# EAGLE design Edin_TinyPico_Nano (EAGLE 8.0.1)

## Sheet 1 of 2
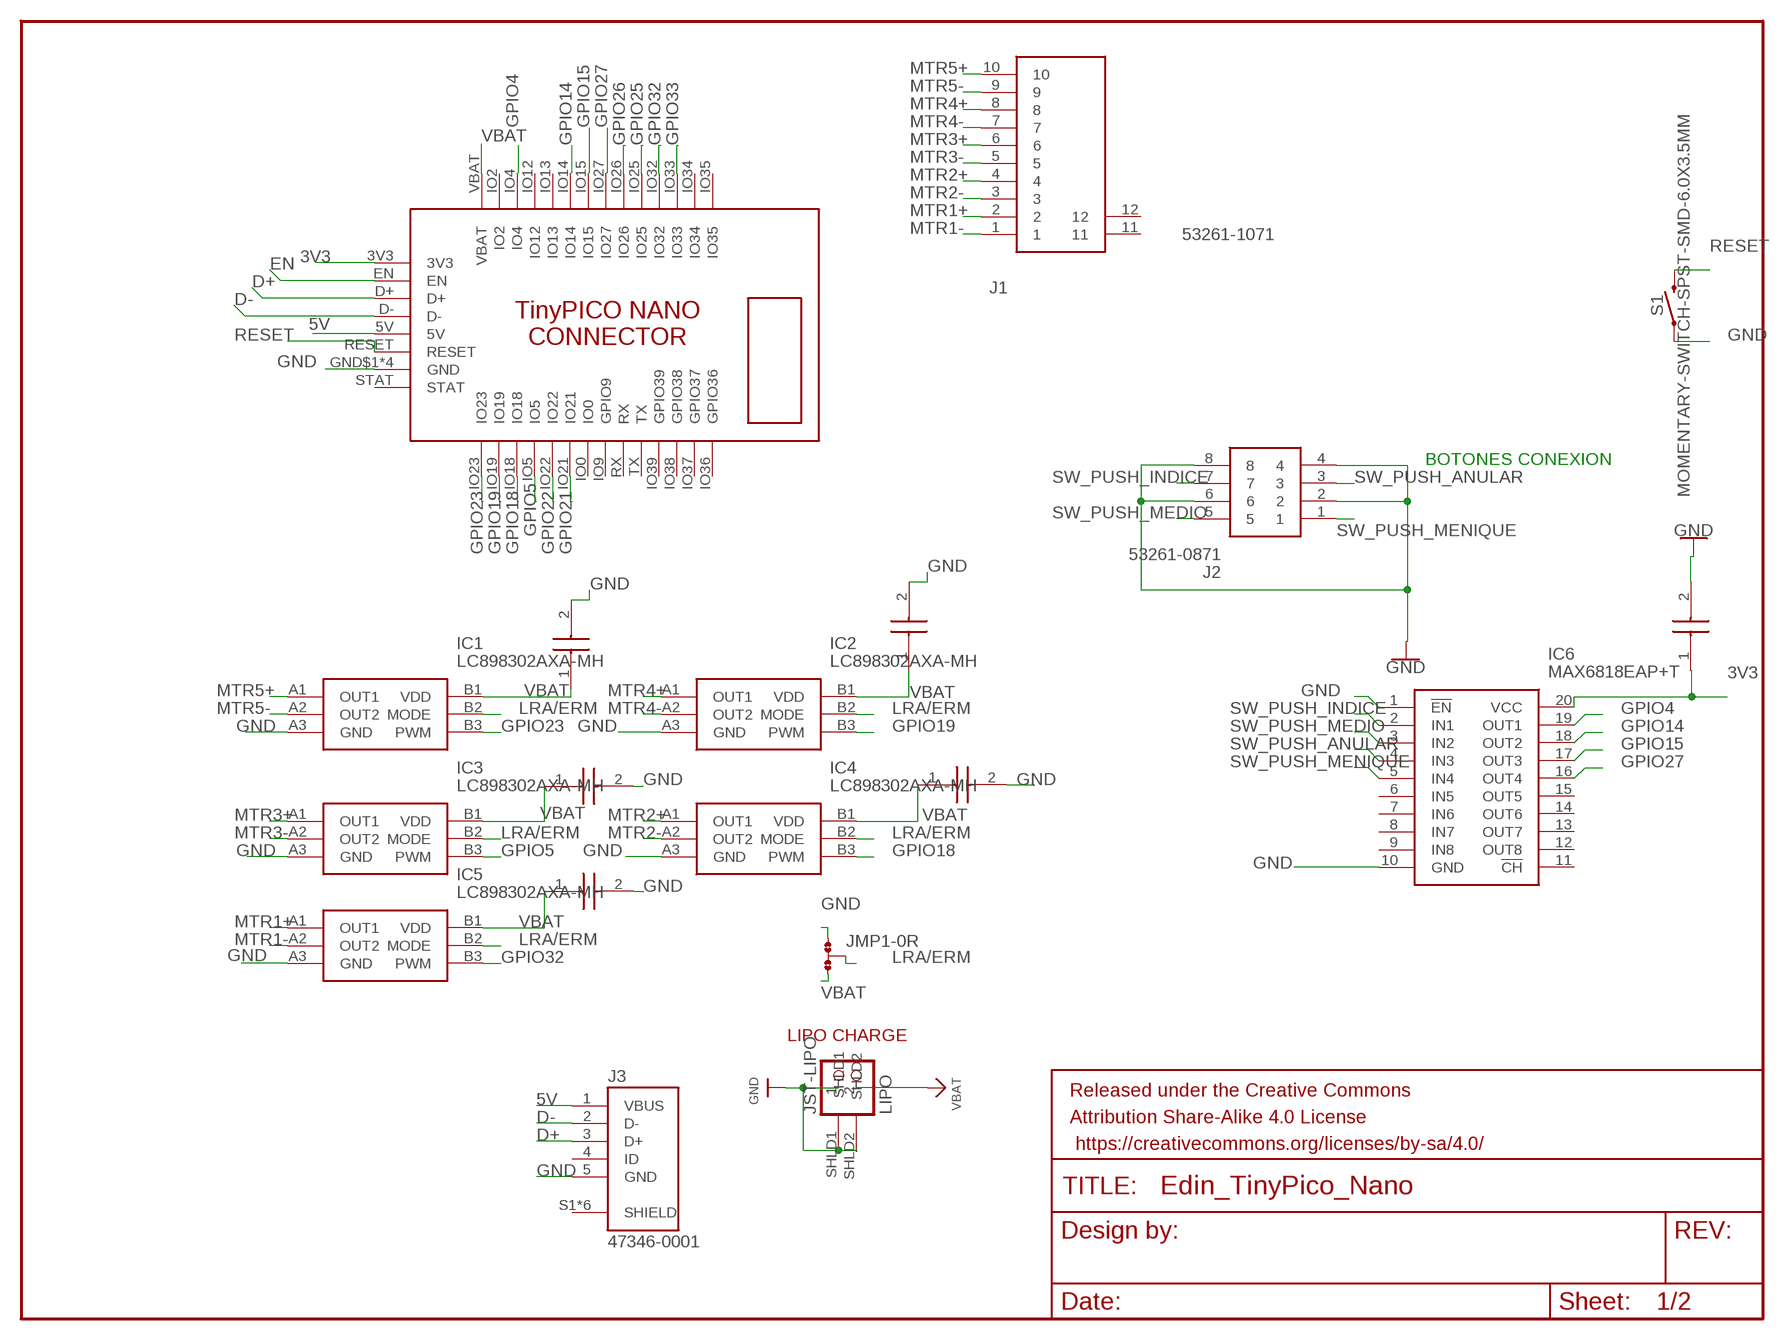
[diagram p0: schematic, sheet 1]

### Parts
C1  0603B104K160CT  [CAPC1608X87N]
C2  0603B104K160CT  [CAPC1608X87N]
C3  0603B104K160CT  [CAPC1608X87N]
C4  0603B104K160CT  [CAPC1608X87N]
C5  0603B104K160CT  [CAPC1608X87N]
C8  0603B104K160CT  [CAPC1608X87N]
FRAME1  FRAME-LETTER  [CREATIVE_COMMONS]
IC1  LC898302AXA-MH  [BGA6C40P3X2_118X78X65]
IC2  LC898302AXA-MH  [BGA6C40P3X2_118X78X65]
IC3  LC898302AXA-MH  [BGA6C40P3X2_118X78X65]
IC4  LC898302AXA-MH  [BGA6C40P3X2_118X78X65]
IC5  LC898302AXA-MH  [BGA6C40P3X2_118X78X65]
IC6  MAX6818EAP+T  [SOP65P778X199-20N]
J1  53261-1071  [532611071]
J2  53261-0871  [53261-0871]
J3  47346-0001  [MOLEX_47346-0001]
JMP1  0R-JUMPA  [A0R-JMP]
JST-LIPO  LIPO  JST_2PIN  [JSTPH2]
S1  MOMENTARY-SWITCH-SPST-SMD-6.0X3.5MM  [TACTILE_SWITCH_SMD_6.0X3.5MM]
U$1  TINYPICO-NANO-CONNECTOR  [TINYPICO-NANO-CONNECTOR]

### Nets
3V3: C8.1 IC6.20(VCC) U$1.3V3
5V: J3.1(VBUS) U$1.5V
D+: J3.3(D+) U$1.D+
D-: J3.2(D-) U$1.D-
EN: U$1.EN
GND: C1.2 C2.2 C3.2 C4.2 C5.2 C8.2 IC1.A3(GND) IC2.A3(GND) IC3.A3(GND) IC4.A3(GND) IC5.A3(GND) IC6.1(!EN) IC6.10(GND) J2.2 J2.4 J2.6 J2.8 J3.5(GND) JMP1.1 JST-LIPO.1 JST-LIPO.SHLD1 JST-LIPO.SHLD2 S1.1 U$1.GND$1(GND) U$1.GND$2(GND) U$1.GND$3(GND) U$1.GND$4(GND)
GPIO4: IC6.19(OUT1) U$1.IO4
GPIO5: IC3.B3(PWM) U$1.IO5
GPIO14: IC6.18(OUT2) U$1.IO14
GPIO15: IC6.17(OUT3) U$1.IO15
GPIO18: IC4.B3(PWM) U$1.IO18
GPIO19: IC2.B3(PWM) U$1.IO19
GPIO21: U$1.IO21
GPIO22: U$1.IO22
GPIO23: IC1.B3(PWM) U$1.IO23
GPIO25: U$1.IO25
GPIO26: U$1.IO26
GPIO27: IC6.16(OUT4) U$1.IO27
GPIO32: IC5.B3(PWM) U$1.IO32
GPIO33: U$1.IO33
LRA/ERM: IC1.B2(MODE) IC2.B2(MODE) IC3.B2(MODE) IC4.B2(MODE) IC5.B2(MODE) JMP1.2
MTR1+: IC5.A1(OUT1) J1.2
MTR1-: IC5.A2(OUT2) J1.1
MTR2+: IC4.A1(OUT1) J1.4
MTR2-: IC4.A2(OUT2) J1.3
MTR3+: IC3.A1(OUT1) J1.6
MTR3-: IC3.A2(OUT2) J1.5
MTR4+: IC2.A1(OUT1) J1.8
MTR4-: IC2.A2(OUT2) J1.7
MTR5+: IC1.A1(OUT1) J1.10
MTR5-: IC1.A2(OUT2) J1.9
RESET: S1.2 U$1.RESET
SW_PUSH_ANULAR: IC6.4(IN3) J2.3
SW_PUSH_INDICE: IC6.2(IN1) J2.7
SW_PUSH_MEDIO: IC6.3(IN2) J2.5
SW_PUSH_MENIQUE: IC6.5(IN4) J2.1
VBAT: C1.1 C2.1 C3.1 C4.1 C5.1 IC1.B1(VDD) IC2.B1(VDD) IC3.B1(VDD) IC4.B1(VDD) IC5.B1(VDD) JMP1.3 JST-LIPO.2 U$1.VBAT
Unconnected: IC6.6(IN5) IC6.7(IN6) IC6.8(IN7) IC6.9(IN8) IC6.11(!CH) IC6.12(OUT8) IC6.13(OUT7) IC6.14(OUT6) IC6.15(OUT5) J1.11 J1.12 J3.4(ID) J3.S1(SHIELD) J3.S2(SHIELD) J3.S3(SHIELD) J3.S4(SHIELD) J3.S5(SHIELD) J3.S6(SHIELD) U$1.IO0 U$1.IO2 U$1.IO9(GPIO9) U$1.IO12 U$1.IO13 U$1.IO34 U$1.IO35 U$1.IO36(GPIO36) U$1.IO37(GPIO37) U$1.IO38(GPIO38) U$1.IO39(GPIO39) U$1.RX U$1.STAT U$1.TX

### Notes on the sheet
- BOTONES CONEXION
- LIPO CHARGE

## Sheet 2 of 2
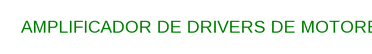
[diagram p1: schematic, sheet 2]

### Notes on the sheet
- AMPLIFICADOR DE DRIVERS DE MOTORES

## Library data of the parts
C1-C5 C8 = SamacSys_Parts:0603B104K160CT: WALSIN - 0603B104K160CT - CAP, 0.1F, 16V, 10%, X7R, 0603 Source: Datasheet <https://componentsearchengine.com/Datasheets/1/0603B104K160CT.pdf>; DESCRIPTION: WALSIN - 0603B104K160CT - CAP, 0.1F, 16V, 10%, X7R, 0603; HEIGHT: 0.87mm; MANUFACTURER_NAME: Walsin Technology Corporation; MANUFACTURER_PART_NUMBER: 0603B104K160CT; MOUSER_PART_NUMBER: 791-0603B104K160CT; MOUSER_PRICE-STOCK: https://www.mouser.com/Search/Refine.aspx?Keyword=791-0603B104K160CT
FRAME1 = SparkFun-Aesthetics:FRAME-LETTER: Schematic Frame - Letter Standard 8.5x11 US Letter frame
IC1-IC5 = SamacSys_Parts:LC898302AXA-MH: Motor / Motion / Ignition Controllers & Drivers Linear Vibrator Driv Source: Datasheet <https://www.arrow.com/en/products/lc898302axa-mh/on-semiconductor>; DESCRIPTION: Motor / Motion / Ignition Controllers & Drivers Linear Vibrator Driv; HEIGHT: 0.65mm; MANUFACTURER_NAME: ON Semiconductor; MANUFACTURER_PART_NUMBER: LC898302AXA-MH; MOUSER_PART_NUMBER: 863-LC898302AXA-MH; MOUSER_PRICE-STOCK: https://www.mouser.co.uk/ProductDetail/ON-Semiconductor/LC898302AXA-MH?qs=raqtESnDWsCbGq19hBfPlw%3D%3D
IC6 = SamacSys_Parts:MAX6818EAP+T: MAXIM INTEGRATED PRODUCTS - MAX6818EAP+T. - ESD PROTE WITH SWITCH DEBOUNCER, SSOP-20 Source: Datasheet; DESCRIPTION: MAXIM INTEGRATED PRODUCTS - MAX6818EAP+T. - ESD PROTE WITH SWITCH DEBOUNCER, SSOP-20; HEIGHT: 1.99mm; MANUFACTURER_NAME: Maxim Integrated; MANUFACTURER_PART_NUMBER: MAX6818EAP+T; MOUSER_PART_NUMBER: 700-MAX6818EAPT; MOUSER_PRICE-STOCK: https://www.mouser.co.uk/ProductDetail/Maxim-Integrated/MAX6818EAP%2bT?qs=CDqwynd4ZNoKt6d34O8j%252BA%3D%3D
J1 = SamacSys_Parts:53261-1071: 10 way SMT r/a header Molex PICOBLADE Series, Series Number 53261, 1.25mm Pitch 10 Way 1 Row Shrouded Right Angle PCB Header, Surface Mount Source: Datasheet <https://www.molex.com/webdocs/datasheets/pdf/en-us/0532611071_PCB_HEADERS.pdf>; DESCRIPTION: 10 way SMT r/a header Molex PICOBLADE Series, Series Number 53261, 1.25mm Pitch 10 Way 1 Row Shrouded Right Angle PCB Header, Surface Mount; HEIGHT: 3mm; MANUFACTURER_NAME: Molex; MANUFACTURER_PART_NUMBER: 53261-1071; MOUSER_PART_NUMBER: 538-53261-1071; MOUSER_PRICE-STOCK: https://www.mouser.co.uk/ProductDetail/Molex/53261-1071?qs=%252B72YyncTwW%252Bzs3RwZTiukQ%3D%3D
J2 = SamacSys_Parts:53261-0871: Molex PICOBLADE Series, Series Number 53261, 1.25mm Pitch, 8 Way 1 Row Shrouded Right Angle PCB Header, Surface Mount Source: Datasheet <http://www.molex.com/webdocs/datasheets/pdf/en-us/0532610871_PCB_HEADERS.pdf>; DESCRIPTION: Molex PICOBLADE Series, Series Number 53261, 1.25mm Pitch, 8 Way 1 Row Shrouded Right Angle PCB Header, Surface Mount; HEIGHT: mm; MANUFACTURER_NAME: Molex; MANUFACTURER_PART_NUMBER: 53261-0871; MOUSER_PART_NUMBER: 538-53261-0871; MOUSER_PRICE-STOCK: https://www.mouser.co.uk/ProductDetail/Molex/53261-0871?qs=%252B72YyncTwW%252BggfdCJ7Netw%3D%3D
J3 = 47346-0001:47346-0001: USB Connectors MICRO USB B RECPT BTTM MOUNT ASSY Check prices <https://pricing.snapeda.com/parts/47346-0001/Molex/view-part?ref=eda>; AVAILABILITY: Warning; DESCRIPTION: USB Connectors MICRO USB B RECPT BTTM MOUNT ASSY; MF: Molex; MP: 47346-0001; PACKAGE: None; PRICE: None; PURCHASE-URL: https://pricing.snapeda.com/search/part/47346-0001/?ref=eda
JMP1 = jump-0r-smd:0R-JUMP: SMD 0R 0805 Jumper
JST-LIPO = UnexpectedMaker:JST_2PIN: JST 2-Pin Right-Angle Connector PH-Series - 4UConnector: 17311 SH-Series - 4UConnector: 07278
S1 = SparkFun-Switches:MOMENTARY-SWITCH-SPST: Momentary Switch (Pushbutton) - SPST Normally-open (NO) SPST momentary switches (buttons, pushbuttons). Variants PTH-12MM - 12mm square, through-hole Momentary Pushbutton Switch - 12mm Square <https://www.sparkfun.com/products/9190> (COM-09190) PTH-6.0MM, PTH-6.0MM-KIT - 6.0mm square, through-hole Mini Pushbutton Switch <https://www.sparkfun.com/products/97> (COM-00097) KIT package intended for soldering kit's - only one side of pads' copper is exposed. PTH-RIGHT-ANGLE-KIT - Right-angle, through-hole Right Angle Tactile Button <https://www.sparkfun.com/products/10791> - Used on SparkFun BigTime Watch Kit <https://www.sparkfun.com/products/11734> SMD-12MM - 12mm square, surface-mount Tactile Button - SMD (12mm) <https://www.sparkfun.com/products/12993> (COM-12993) Used on SparkFun PicoBoard <https://www.sparkfun.com/products/11888> SMD-4.5MM - 4.5mm Square Trackball Switch Used on SparkFun Blackberry Trackballer Breakout <https://www.sparkfun.com/products/13169> SMD-4.6MMX2.8MM - 4.60mm x 2.80mm, surface mount Used on SparkFun SAMD21 Mini Breakout <https://www.sparkfun.com/products/13664> SMD-5.2MM, SMD-5.2-REDUNDANT - 5.2mm square, surface-mount Mini Pushbutton Switch - SMD <https://www.sparkfun.com/products/8720> (COM-08720) Used on Arduino Pro Mini <https://www.sparkfun.com/products/11114> REDUNDANT package connects both switch circuits together SMD-6.0X3.5MM - 6.0 x 3.5mm, surface mount Momentary Reset Switch SMD <https://www.sparkfun.com/products/8229> (COM-08229) SMD-6.2MM-TALL - 6.2mm square, surface mount Tactile Button - SMD (6mm) <https://www.sparkfun.com/products/12992> Used on SparkFun Digital Sandbox <https://www.sparkfun.com/products/12651> SMD-RIGHT-ANGLE - Right-angle, surface mount Used on SparkFun Block for Intel® Edison - Arduino <https://www.sparkfun.com/products/13036>; PROD_ID: SWCH-00815; SF_SKU: COM-08229
U$1 = TinyPICO_NANO_Eagle:TINYPICO-NANO-CONNECTOR: TinyPICO NANO Footprint https://www.tinypico.com/tinypico-nano

## Board
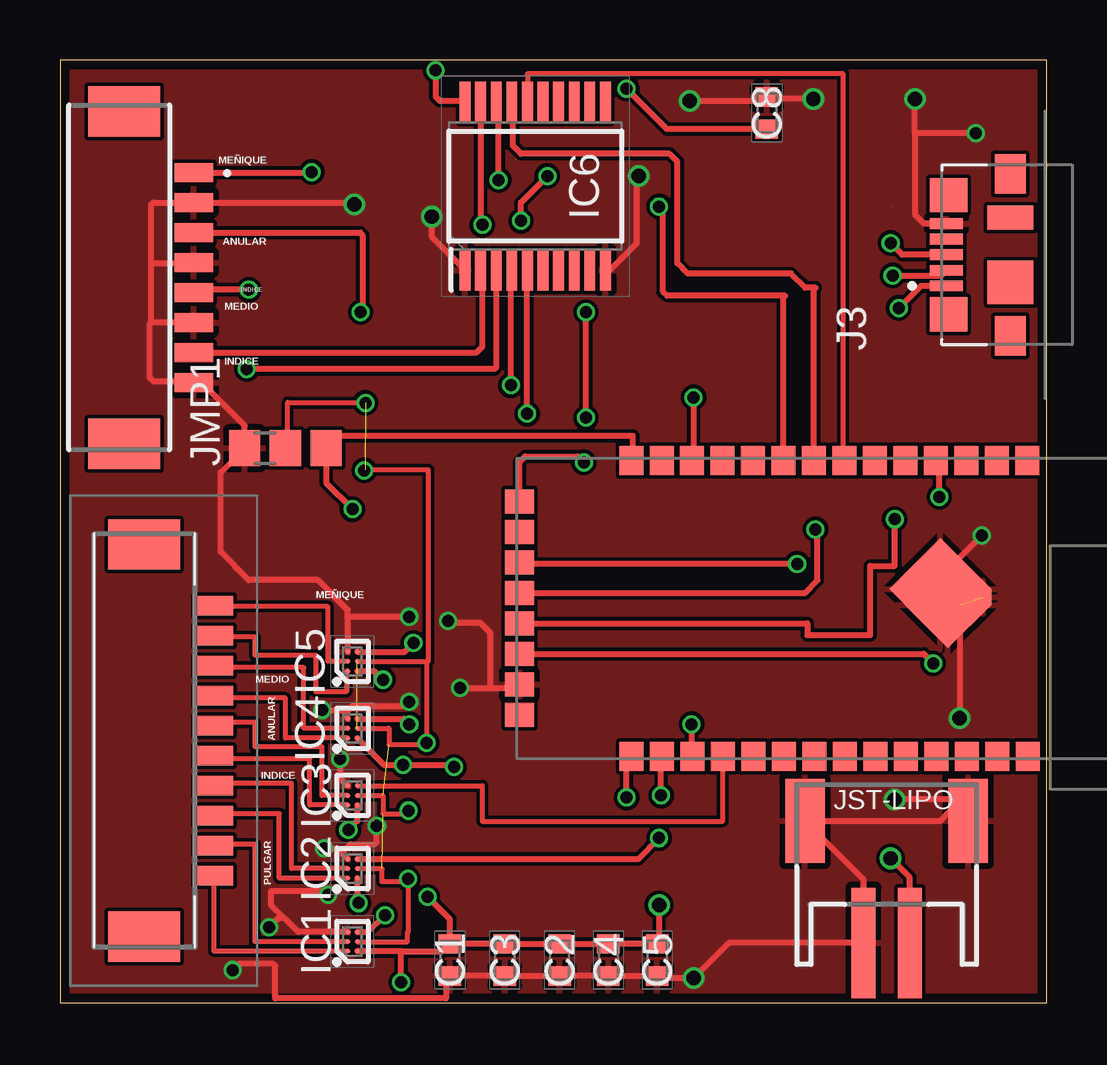
[diagram p2: board, top side]
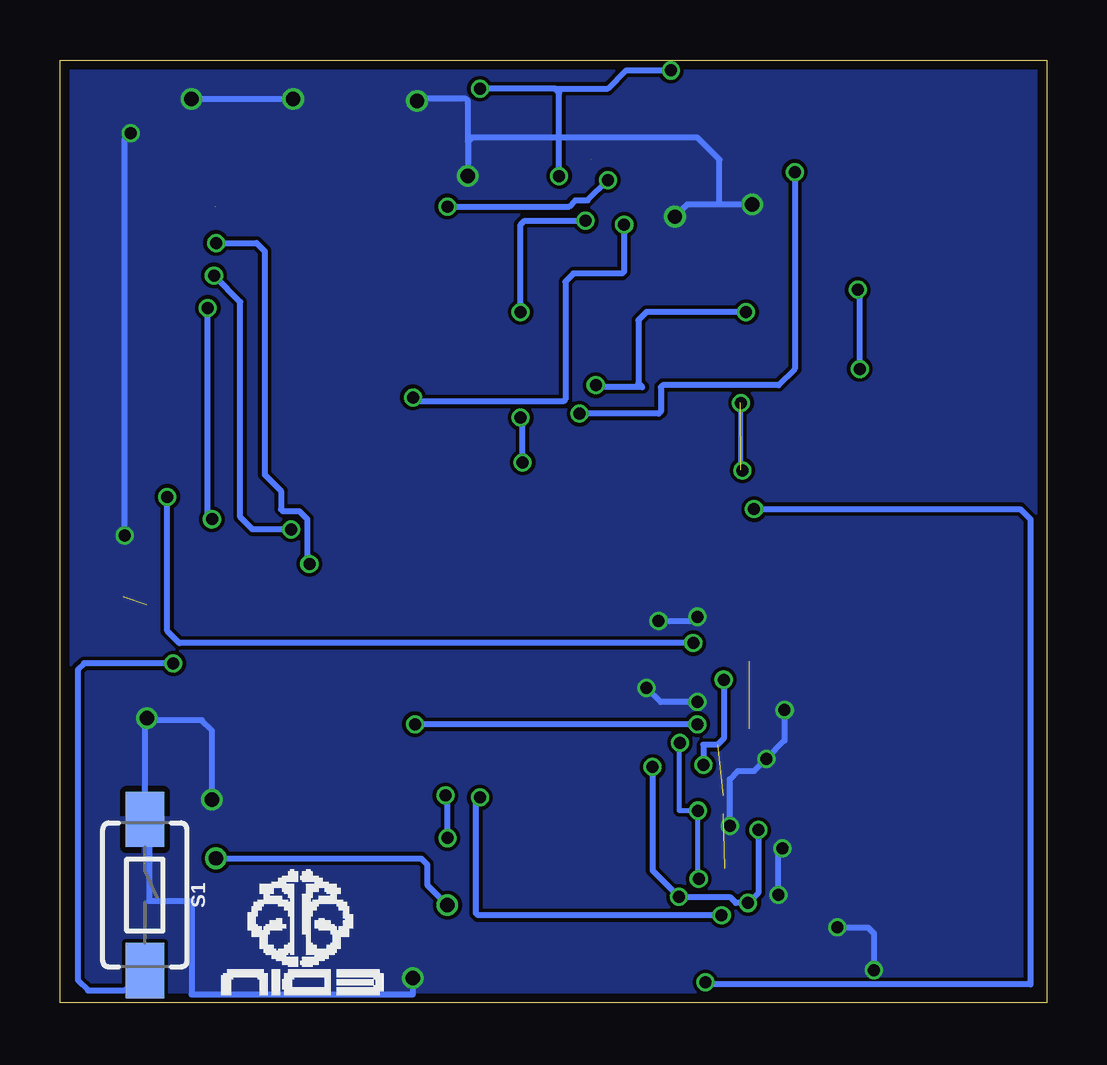
[diagram p3: board, bottom side, seen from below]

Size 41.13 x 39.29 mm. Coordinates in mm from the lower left corner, seen from the top.
Outline: 0,0 41.13,0 41.13,39.29 0,39.29 0,0
Copper layers (1*16): Top 0.035559375mm / dielectric 1.6mm / Bottom 0.035559375mm
Design rules "oshpark-2layer": minimum track width 6mil, minimum drill 10mil, track to track 6mil, track to pad 6mil, pad to pad 6mil, via to via 6mil, smd to smd 6mil, copper to edge 15mil, drill to drill 6mil, minimum pad ring 5mil, minimum via ring 5mil, stop-mask expansion 2.5mil, vias tented up to drill 0mil, thermal gap 10mil

### Footprints (pad centres in the part's own frame; a part is rotated, then mirrored left to right if it is on the bottom)
CAPC1608X87N = smd 0.8 x 0.94: 1 -0.67,0; 2 0.67,0
BGA6C40P3X2_118X78X65 = smd 0.2 x 0.2: A1 -0.4,0.2; A2 0,0.2; A3 0.4,0.2; B1 -0.4,-0.2; B2 0,-0.2; B3 0.4,-0.2
SOP65P778X199-20N = smd 1.705 x 0.45: 1 -3.498,2.925; 2 -3.498,2.275; 3 -3.498,1.625; 4 -3.498,0.975; 5 -3.498,0.325; 6 -3.498,-0.325; 7 -3.498,-0.975; 8 -3.498,-1.625; 9 -3.498,-2.275; 10 -3.498,-2.925; 11 3.498,-2.925; 12 3.498,-2.275; 13 3.498,-1.625; 14 3.498,-0.975; 15 3.498,-0.325; 16 3.498,0.325; 17 3.498,0.975; 18 3.498,1.625; 19 3.498,2.275; 20 3.498,2.925
532611071 = smd 0.8 x 1.6: 1 -5.625,2.1; 2 -4.375,2.1; 3 -3.125,2.1; 4 -1.875,2.1; 5 -0.625,2.1; 6 0.625,2.1; 7 1.875,2.1; 8 3.125,2.1; 9 4.375,2.1; 10 5.625,2.1 | smd 2.1 x 3: 11 -8.175,-0.8; 12 8.175,-0.8
53261-0871 = smd 0.8 x 1.6: 1 -4.375,1.004; 2 -3.125,1.004; 3 -1.875,1.004; 4 -0.625,1.004; 5 0.625,1.004; 6 1.875,1.004; 7 3.125,1.004; 8 4.375,1.004 | smd 2.1 x 3: 9 6.925,-1.896; 10 -6.925,-1.896
MOLEX_47346-0001 = smd 0.45 x 1.38: 1 -1.3,2.66; 2 -0.65,2.66; 3 0,2.66; 4 0.65,2.66; 5 1.3,2.66 | smd 1.425 x 1.55: S1 -2.487,2.575; S2 2.487,2.575 | smd 1.65 x 1.3: S3 -3.375,0; S6 3.375,0 | smd 1.8 x 1.9: S4 -1.15,0 | smd 1 x 1.9: S5 1.55,0
A0R-JMP = smd 1.5 x 1.3: 1 0,1.7; 2 0,0; 3 0,-1.7
JSTPH2 = smd 1 x 4.6: 1 -0.965,-3.607; 2 0.965,-3.607 | smd 1.651 x 3.505: SHLD1 -3.4,1.473; SHLD2 3.4,1.473
TACTILE_SWITCH_SMD_6.0X3.5MM = smd 2.3 x 1.6: 1 -3.15,0; 2 3.15,0
TINYPICO-NANO-CONNECTOR = smd 1.2 x 1: 3V3 0.1,10.725; 5V 0.1,5.645; D+ 0.1,8.185; D- 0.1,6.915; EN 0.1,9.455; GND$1 0.1,3.105; RESET 0.1,4.375; STAT 0.1,1.835 | smd 3 x 3 rotated 45: GND$2 17.643,7.082 | smd 0.66 x 0.671: GND$3 19.436,6.746 | smd 2.54 x 2.54 rotated 45: GND$4 17.971,6.413 | smd 1 x 1.2: IO0 12.395,0.1; IO2 6.034,12.44; IO4 7.304,12.44; IO5 8.585,0.1; IO9 13.665,0.1; IO12 8.574,12.44; IO13 9.844,12.44; IO14 11.114,12.44; IO15 12.384,12.44; IO18 7.315,0.1; IO19 6.045,0.1; IO21 11.125,0.1; IO22 9.855,0.1; IO23 4.775,0.1; IO25 16.194,12.44; IO26 14.924,12.44; IO27 13.654,12.44; IO32 17.464,12.44; IO33 18.734,12.44; IO34 20.004,12.44; IO35 21.274,12.44; IO36 21.285,0.1; IO37 20.015,0.1; IO38 18.745,0.1; IO39 17.475,0.1; RX 14.935,0.1; TX 16.205,0.1; VBAT 4.764,12.44

### Placement (x,y rotation side)
C1  16.26,1.78 270 top
C2  20.83,1.78 270 top
C3  18.54,1.78 270 top
C4  22.86,1.78 270 top
C5  24.89,1.78 270 top
C8  29.46,37.08 90 top
FRAME1  24.13,68.58 0 top  (outside the outline)
IC1  12.19,2.54 90 top
IC2  12.19,5.59 90 top
IC3  12.19,8.64 90 top
IC4  12.19,11.43 90 top
IC5  12.19,14.22 90 top
IC6  19.81,34.04 90 top
J1  4.32,10.92 270 top
J2  4.57,30.23 270 top
J3  39.61,31.18 90 top
JMP1  9.4,23.11 90 top
JST-LIPO  34.46,6.1 0 top
S1  37.59,4.48 270 bottom
U$1  19.05,10.16 0 top

### Tracks (layer width: path | path; a pad name or v marks a point on that pad's centre or on a via)
3V3  (via drill 0.5)
  Top 0.254: C8.1 25.3,36.41 v23.62,38.1 | v15.66,38.86 15.66,37.76 15.83,37.59 16.83,37.59 IC6.20 | U$1.3V3 19.15,22.54 19.39,22.77 21.59,22.77 v21.84,22.52 | v21.93,24.38 v21.93,28.78 | v19.22,32.59 19.22,33.35 v20.32,34.46
  Bottom 0.254: 20.49,38.1 v23.62,38.1 | 20.49,38.1 18.29,38.1 17.52,38.86 v15.66,38.86 | v21.84,22.52 21.84,24.3 v21.93,24.38 | v21.93,28.78 21.93,32.42 21.76,32.59 v19.22,32.59 | v20.32,34.46 20.32,37.93 20.49,38.1
5V  (via drill 0.5)
  Top 0.254: U$1.5V 31.15,15.8 31.15,15.32 33.78,15.32 33.78,15.41 33.78,18.2 34.8,18.2 v34.8,20.15 | J3.1 35.89,29.88 v34.96,28.95
  Bottom 0.254: v34.8,20.15 34.96,20.15 v34.96,28.95
D+  (via drill 0.5)
  Top 0.254: J3.3 35.11,31.18 v34.62,31.66 | v30.73,18.29 19.21,18.29 U$1.D+
  Bottom 0.254: v34.62,31.66 32.93,31.66 32.59,31.32 32.59,22.01 31.92,21.33 31.92,20.57 31.83,20.49 31.15,20.49 30.82,20.15 30.82,18.37 v30.73,18.29
D-  (via drill 0.5)
  Top 0.254: U$1.D- 31.04,17.07 31.58,17.61 31.58,19.64 v31.49,19.73 | v34.71,30.31 36.74,30.31 J3.2
  Bottom 0.254: v31.49,19.73 33.1,19.73 33.61,20.23 33.61,29.21 v34.71,30.31
GND  (via drill 0.5, 0.6)  (1 unrouted)
  Top 0.254: v37.5,11.85 37.5,16.57 U$1.GND$4 37.02,18.06 v38.44,19.47 | J3.5 36.01,32.48 35.64,32.85 35.64,36.23 | 35.64,36.23 v35.64,37.67 | v31.41,37.67 29.55,37.67 C8.2 29.3,37.59 v26.24,37.59 | IC6.10 22.92,30.54 24.04,31.66 24.04,34.37 v24.13,34.46 | 6.09,25.65 7.7,24.05 JMP1.1 6.69,22.1 6.69,18.79 7.87,17.61 10.75,17.61 11.99,16.37 11.99,16 | J2.6 3.8,28.35 | 3.8,28.35 3.73,28.28 3.73,26.07 3.89,25.91 5.52,25.91 J2.8 | 3.8,28.35 3.8,30.81 | 3.8,30.81 3.81,30.82 5.54,30.82 J2.4 | 3.8,30.81 3.8,33.26 3.89,33.35 J2.2 12.2,33.35 v12.28,33.27 | v15.49,32.76 15.49,31.93 IC6.1 | v34.8,8.47 37.59,8.47 36.69,7.57 JST-LIPO.SHLD1 33.49,5.13 JST-LIPO.1 27.89,2.49 v26.41,1.02 24.89,1.02 C5.2 C4.2 C2.2 C3.2 C1.2 16.09,1.11 16.09,0.17 8.97,0.17 8.97,0.34 8.97,1.52 8.89,1.61 7.45,1.61 v7.2,1.35 | 11.99,16 IC5.A3 | IC4.A3 11.99,12.16 | 11.99,12.16 12.19,12.36 14.39,12.36 v14.56,12.53 | v16.68,13.12 19.01,13.12 U$1.GND$1 | 17.95,13.12 17.95,15.41 17.52,15.83 16.25,15.83 v16.17,15.92 | v14.56,16.09 12.08,16.09 11.99,16 | IC1.A3 9.93,2.94 9.36,3.51 | 9.36,3.51 8.8,4.06 8.8,4.66 11.01,4.66 v11.18,4.49 | v11.01,6.43 11.55,6.43 11.7,6.28 | 11.7,6.28 IC2.A3 | 11.7,6.28 11.78,6.28 12.11,6.6 13.12,6.6 13.21,6.69 v13.21,7.37 | v11.68,10.16 11.68,9.35 IC3.A3 | 11.99,12.16 10.95,12.16 v10.92,12.19 | 9.36,3.51 9.1,3.51 v8.72,3.13 | v38.18,36.23 35.64,36.23
  Bottom 0.254: v26.41,1.02 26.41,0.34 35.64,0.34 35.64,4.23 37.42,4.23 37.42,7.63 S1.1 37.59,11.85 v37.5,11.85 37.42,11.77 35.22,11.77 34.8,11.34 v34.8,8.47 | v35.64,37.67 v31.41,37.67 | 24.13,35.9 v24.13,34.46 | 24.13,35.9 24.13,37.59 24.21,37.67 26.16,37.67 v26.24,37.59 | v12.28,33.27 13.63,33.27 | 13.63,33.27 14.98,33.27 v15.49,32.76 | v14.56,12.53 16.09,12.53 v16.68,13.12 | v16.17,15.92 14.73,15.92 v14.56,16.09 | v11.18,4.49 11.18,6.26 v11.01,6.43 | v13.21,7.37 13.21,9.31 12.87,9.65 12.19,9.65 v11.68,10.16 10.92,10.92 v10.92,12.19 | v8.72,3.13 7.45,3.13 7.2,2.88 v7.2,1.35 | 13.63,33.27 13.63,35.13 14.56,36.06 23.96,36.06 24.13,35.9 | v38.44,19.47 38.44,35.98 v38.18,36.23
  pour Top: -0.51,39.62 -0.51,-0.76 40.89,-1.27 40.89,39.12
  pour Bottom: -0.51,39.88 -0.51,-0.51 40.89,-0.25 40.89,40.13
GPIO4  (via drill 0.5)
  Top 0.254: IC6.19 17.54,32.5 v17.61,32.42 | v26.41,25.23 26.41,22.66 U$1.IO4
  Bottom 0.254: v17.61,32.42 17.61,30.48 17.69,30.39 19.73,30.39 20.06,30.05 20.06,25.14 20.15,25.06 26.24,25.06 v26.41,25.23
GPIO5
  Top 0.203: IC3.B3 17.59,9.04 17.59,7.56 27.64,7.56 U$1.IO5
GPIO14  (via drill 0.5)
  Top 0.254: U$1.IO14 30.16,29.4 30.22,29.46 25.31,29.46 25.14,29.63 25.14,33.02 v24.97,33.19 | v18.29,34.29 18.29,37.44 IC6.18
  Bottom 0.254: v24.97,33.19 19.89,33.19 19.64,33.44 19.13,33.44 v18.29,34.29
GPIO15
  Top 0.254: U$1.IO15 31.43,29.74 31.49,29.8 31.07,29.8 30.48,30.39 26.16,30.39 25.74,30.82 25.74,35.05 25.4,35.39 19.22,35.39 18.88,35.73 18.88,37.49 IC6.17
GPIO18  (via drill 0.5)
  Top 0.254: IC4.B3 14.33,11.83 v14.56,11.6 | v26.33,11.6 26.33,10.3 U$1.IO18
  Bottom 0.254: v14.56,11.6 v26.33,11.6
GPIO19  (via drill 0.5)
  Top 0.254: IC2.B3 24.11,5.99 v24.97,6.86 | v25.06,8.63 25.06,10.22 U$1.IO19
  Bottom 0.254: v24.97,6.86 24.97,8.55 v25.06,8.63
GPIO23  (via drill 0.5)
  Top 0.254: IC1.B3 12.85,2.94 v13.54,3.64 | v23.62,8.55 23.62,10.05 U$1.IO23
  Bottom 0.254: v13.54,3.64 23.7,3.64 23.79,3.73 23.79,8.38 v23.62,8.55
GPIO27
  Top 0.203: U$1.IO27 32.65,22.6 32.65,38.72 19.49,38.72 IC6.16
GPIO32  (via drill 0.5)
  Top 0.254: IC5.B3 14.37,14.62 v14.73,14.98 | v36.66,21.08 36.66,22.46 U$1.IO32
  Bottom 0.254: v14.73,14.98 36.15,14.98 36.66,15.49 v36.66,21.08
LRA/ERM  (4 unrouted)
  Top 0.203: JMP1.2 9.5,23.11 9.5,25.02 12.76,25.02 | IC1.B2 14.48,2.54 14.48,2.91 14.5,2.91 14.5,5.04 | IC2.B2 13.42,5.59 13.42,5.54 13.41,5.54 13.41,5.04 14.5,5.04 | 14.5,5.04 14.5,5.13 | IC3.B2 13.46,8.64 13.46,7.87 14.54,7.87 14.54,7.98 | IC4.B2 13.7,11.43 13.7,11.45 13.71,11.45 13.71,10.76 15.31,10.76 15.31,10.81 | IC5.B2 15.29,14.22 | 15.29,14.22 15.29,14.19 | 15.29,14.22 15.36,14.22 15.36,22.21 12.73,22.21
MTR1+
  Top 0.203: 6.42,15.24 J1.2 6.42,15.24 | IC5.A1 11.94,13.82 11.94,12.95 10.67,12.95 10.67,14.22 10.67,14.48 8.13,14.48 8.13,15.24 6.42,15.24
MTR1-
  Top 0.203: IC5.A2 11.18,14.22 11.18,16.51 6.42,16.51 J1.1
MTR2+
  Top 0.203: 6.42,12.7 J1.4 6.42,12.7 | IC4.A1 9.4,11.03 9.4,12.7 6.42,12.7
MTR2-
  Top 0.203: IC4.A2 10.16,11.43 10.16,13.97 6.42,13.97 J1.3
MTR3+
  Top 0.203: 6.42,10.16 J1.6 6.42,10.16 | IC3.A1 10.41,8.24 10.41,10.16 6.42,10.16
MTR3-
  Top 0.203: IC3.A2 10.92,8.64 10.92,10.67 8.13,10.67 8.13,11.68 6.42,11.68 J1.5
MTR4+
  Top 0.203: 6.42,7.87 J1.8 6.42,7.87 | IC2.A1 9.14,5.19 9.14,7.87 6.42,7.87
MTR4-
  Top 0.203: 6.42,8.89 J1.7 6.42,9.14 9.65,9.14 9.65,5.59 IC2.A2
MTR5+
  Top 0.203: IC1.A1 6.42,2.14 J1.10
MTR5-
  Top 0.203: 6.42,6.35 J1.9 6.42,6.6 8.13,6.6 8.13,2.54 IC1.A2
N$8  (via drill 0.5 pad 0.25)
  other vias: 12.73,24.99
N$15  (via drill 0.5 pad 0.25)
  Bottom 0.203: v14.5,5.16 14.54,5.16 14.54,7.97
N$16  (via drill 0.5 pad 0.25)
  Bottom 0.203: v14.53,8 15.31,8 15.31,10.79
N$18  (via drill 0.5 pad 0.25)
  Top 0.203: v15.28,10.83 15.31,10.83 15.31,14.24
N$19  (via drill 0.5 pad 0.25)
  Bottom 0.203: v12.68,22.18 12.75,22.18 12.75,25.02
N$24  (1 unrouted)
N$31  (1 unrouted)
RESET  (via drill 0.5)
  Top 0.254: U$1.RESET 36.01,14.54 v36.4,14.14
  Bottom 0.254: v36.4,14.14 40.13,14.14 40.38,13.88 40.38,0.93 39.96,0.51 38.41,0.51 S1.2
SW_PUSH_ANULAR  (via drill 0.5)
  Top 0.254: J2.3 12.51,32.1 12.61,32 12.61,28.87 v12.53,28.78 | v18.79,25.74 18.79,30.5 IC6.4
  Bottom 0.254: v12.53,28.78 16.68,28.78 17.02,28.45 17.02,25.82 16.85,25.65 18.71,25.65 v18.79,25.74
SW_PUSH_INDICE
  Top 0.254: J2.7 17.36,27.1 17.61,27.34 17.61,30.47 IC6.2
SW_PUSH_MEDIO  (via drill 0.5)
  Top 0.254: IC6.3 18.19,26.48 18.12,26.41 v7.79,26.41 | v7.87,29.71 5.69,29.71 J2.5
  Bottom 0.254: v7.79,26.41 7.79,29.63 v7.87,29.71
SW_PUSH_MENIQUE  (via drill 0.5)
  Top 0.254: J2.1 10.47,34.6 v10.5,34.62 | v19.47,24.55 19.47,30.52 IC6.5
  Bottom 0.254: v10.5,34.62 10.5,26.41 11.18,25.74 16,25.74 16.09,25.65 16.09,24.64 16.17,24.55 v19.47,24.55
VBAT  (via drill 0.5, 0.6)
  Top 0.254: U$1.VBAT 23.88,22.6 23.88,23.62 11.1,23.62 JMP1.3 11.1,21.66 v12.19,20.57 | C1.1 C3.1 C2.1 C4.1 C5.1 24.97,2.53 v24.97,4.06 | JST-LIPO.2 35.42,5.21 v34.62,6.01 | IC2.B1 12.39,4.2 v12.45,4.15 | 14.22,2.14 IC1.B1 | 14.22,2.14 15.95,2.14 C1.1 | C1.1 16.26,3.47 v15.32,4.4 | IC3.B1 12.39,7.57 v12.02,7.2 | IC5.B1 13.1,13.82 v13.46,13.46 | IC4.B1 13.52,9.9 v14.31,9.9 16.34,9.9 v16.42,9.82 | v14.22,0.85 14.22,2.14
  Bottom 0.254: v34.62,6.01 26.07,6.01 25.82,5.76 25.82,4.91 v24.97,4.06 | v15.32,4.4 13.21,4.4 12.95,4.15 v12.45,4.15 12.02,4.57 v12.02,7.2 | 15.41,4.32 v15.32,4.4 | v13.46,13.46 13.46,11.01 13.71,10.75 14.31,10.75 v14.31,9.9 | v16.42,9.82 16.42,5.5 v15.32,4.4 | v12.19,20.57 1.1,20.57 0.68,20.15 0.68,0.76 14.14,0.76 v14.22,0.85

### Text on the board
tPlace: MEÑIQUE | ANULAR | INDICE | MEDIO | INDICE | MEÑIQUE | MEDIO | ANULAR | INDICE | PULGAR